# Altium schematic sheet photoDetector.SchDoc
size 420 x 297 mm; SheetNumber: 1; SheetTotal: 1; DocumentName: Sheet1.SCHDOC
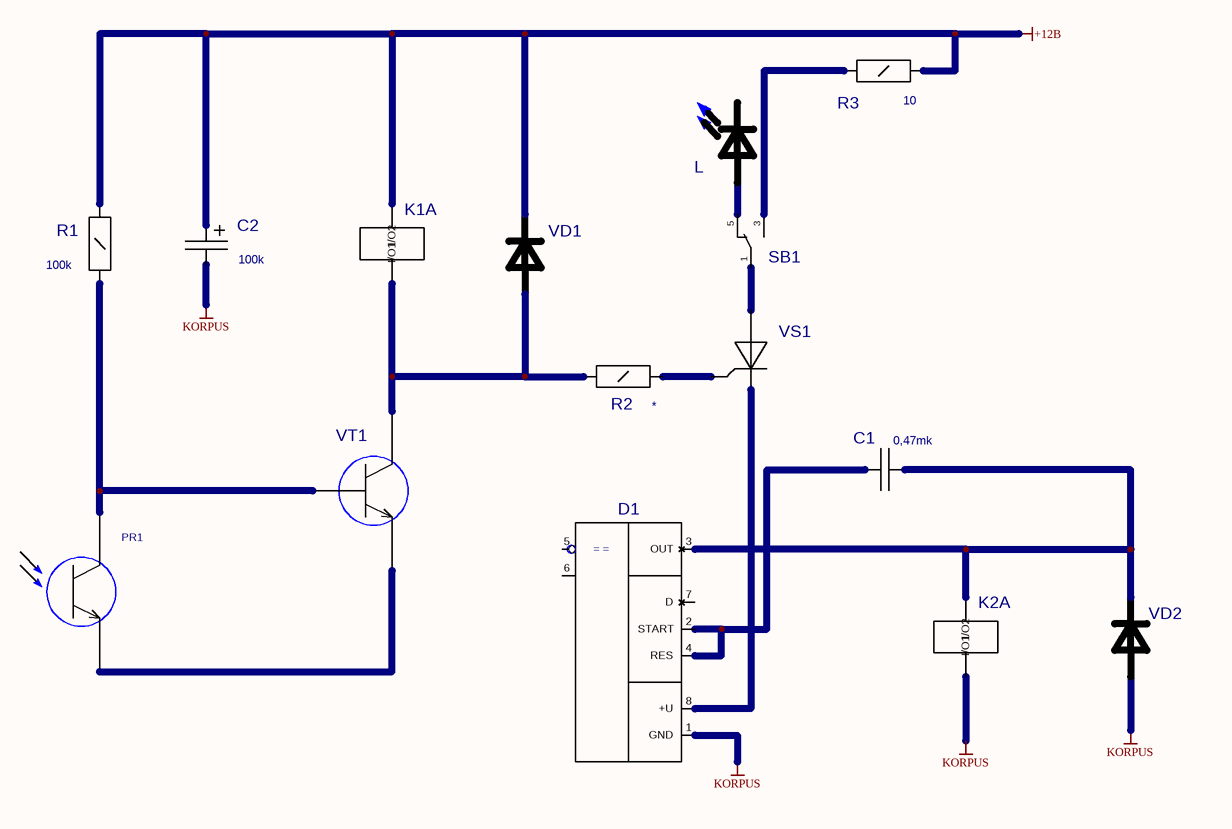
[diagram p0: photoDetector.SchDoc]

## Parts
C1  value 0,47mk  [CC2220]  (hidden comment: CC2220)
C2  value 100k  [CE6032_C]  (hidden comment: CE6032-C)
D1  KR1006VI1  [DIP8]  (value not drawn)
K1  РЭС-64  [RES64]  (value not drawn)  (part A of 2)
K2  РЭС-64  [RES64]  (value not drawn)  (part A of 2)
L  АЛ307КМ  [LED-5MM]  (value not drawn)
PR1  L-53P3C  [L-53P3C]  (value not drawn)
R1  value 100k  [C2-33H-0.25W]  (hidden comment: C2-33H-0.25W_OLD_UGO)
R2  C2-33H-0.25W_OLD_UGO  [C2-33H-0.25W]  (value not drawn)
R3  value 10  [C2-33H-0.25W]  (hidden comment: C2-33H-0.25W_OLD_UGO)
SB1  CB-6600  [CB-6600]  (value not drawn)
VD1  КД521Б  [КД521(522)]  (value not drawn)
VD2  КД521Б  [КД521(522)]  (value not drawn)
VS1  KU101  [KU101]  (value not drawn)
VT1  КТ315Б  [KT13]  (value not drawn)

## Nets
+12B: C2.1 K1.2(I/O2) R1.2 R3.1 VD1.2(K)
KORPUS: C2.2 D1.1(GND) K2.1(I/O1) VD2.1(A)
NetC1_1: C1.1 D1.2(START) D1.4(RES)
NetC1_2: C1.2 D1.3(OUT) K2.2(I/O2) VD2.2(K)
NetD1_8: D1.8(+U) VS1.2(I/OB)
NetK1_1: K1.1(I/O1) R2.2 VD1.1(A) VT1.3(K)
NetL_1: L.1(A) SB1.5
NetPR1_E: PR1.E VT1.1(E)
NetPR1_K: PR1.K R1.1 VT1.2(B)
NetR2_1: R2.1 VS1.3(IN)
NetR3_2: R3.2 SB1.3
NetSB1_1: SB1.1 VS1.1(I/OA)

Not connected (* = marked no-connect by the designer): D1 5(IN1) 6(IN2) 7(D); K1 5; K2 5; L 2(K); SB1 2 4

## Library data of the parts
R1-R3 = C2-33H-0.25W_OLD_UGO: Autor: pcbdesigner.ru
  R2: Value: *
D1 = KR1006VI1: Value: *
K1 K2 = РЭС-64: Value: *
PR1 = L-53P3C: Value: *
SB1 = CB-6600: Value: *; Author: pcbdesigner.ru
VD1 VD2 = КД521Б: Value: *
VS1 = KU101: Value: *
VT1 = КТ315Б: Value: *